# EasyEDA schematic EasyEDA - Encoder Breakout Schematic.json
TITLE: New Schematic; REV: 1.0; Date: 2018-07-22; Sheet: 1/1; Drawn By: NorthernChemist
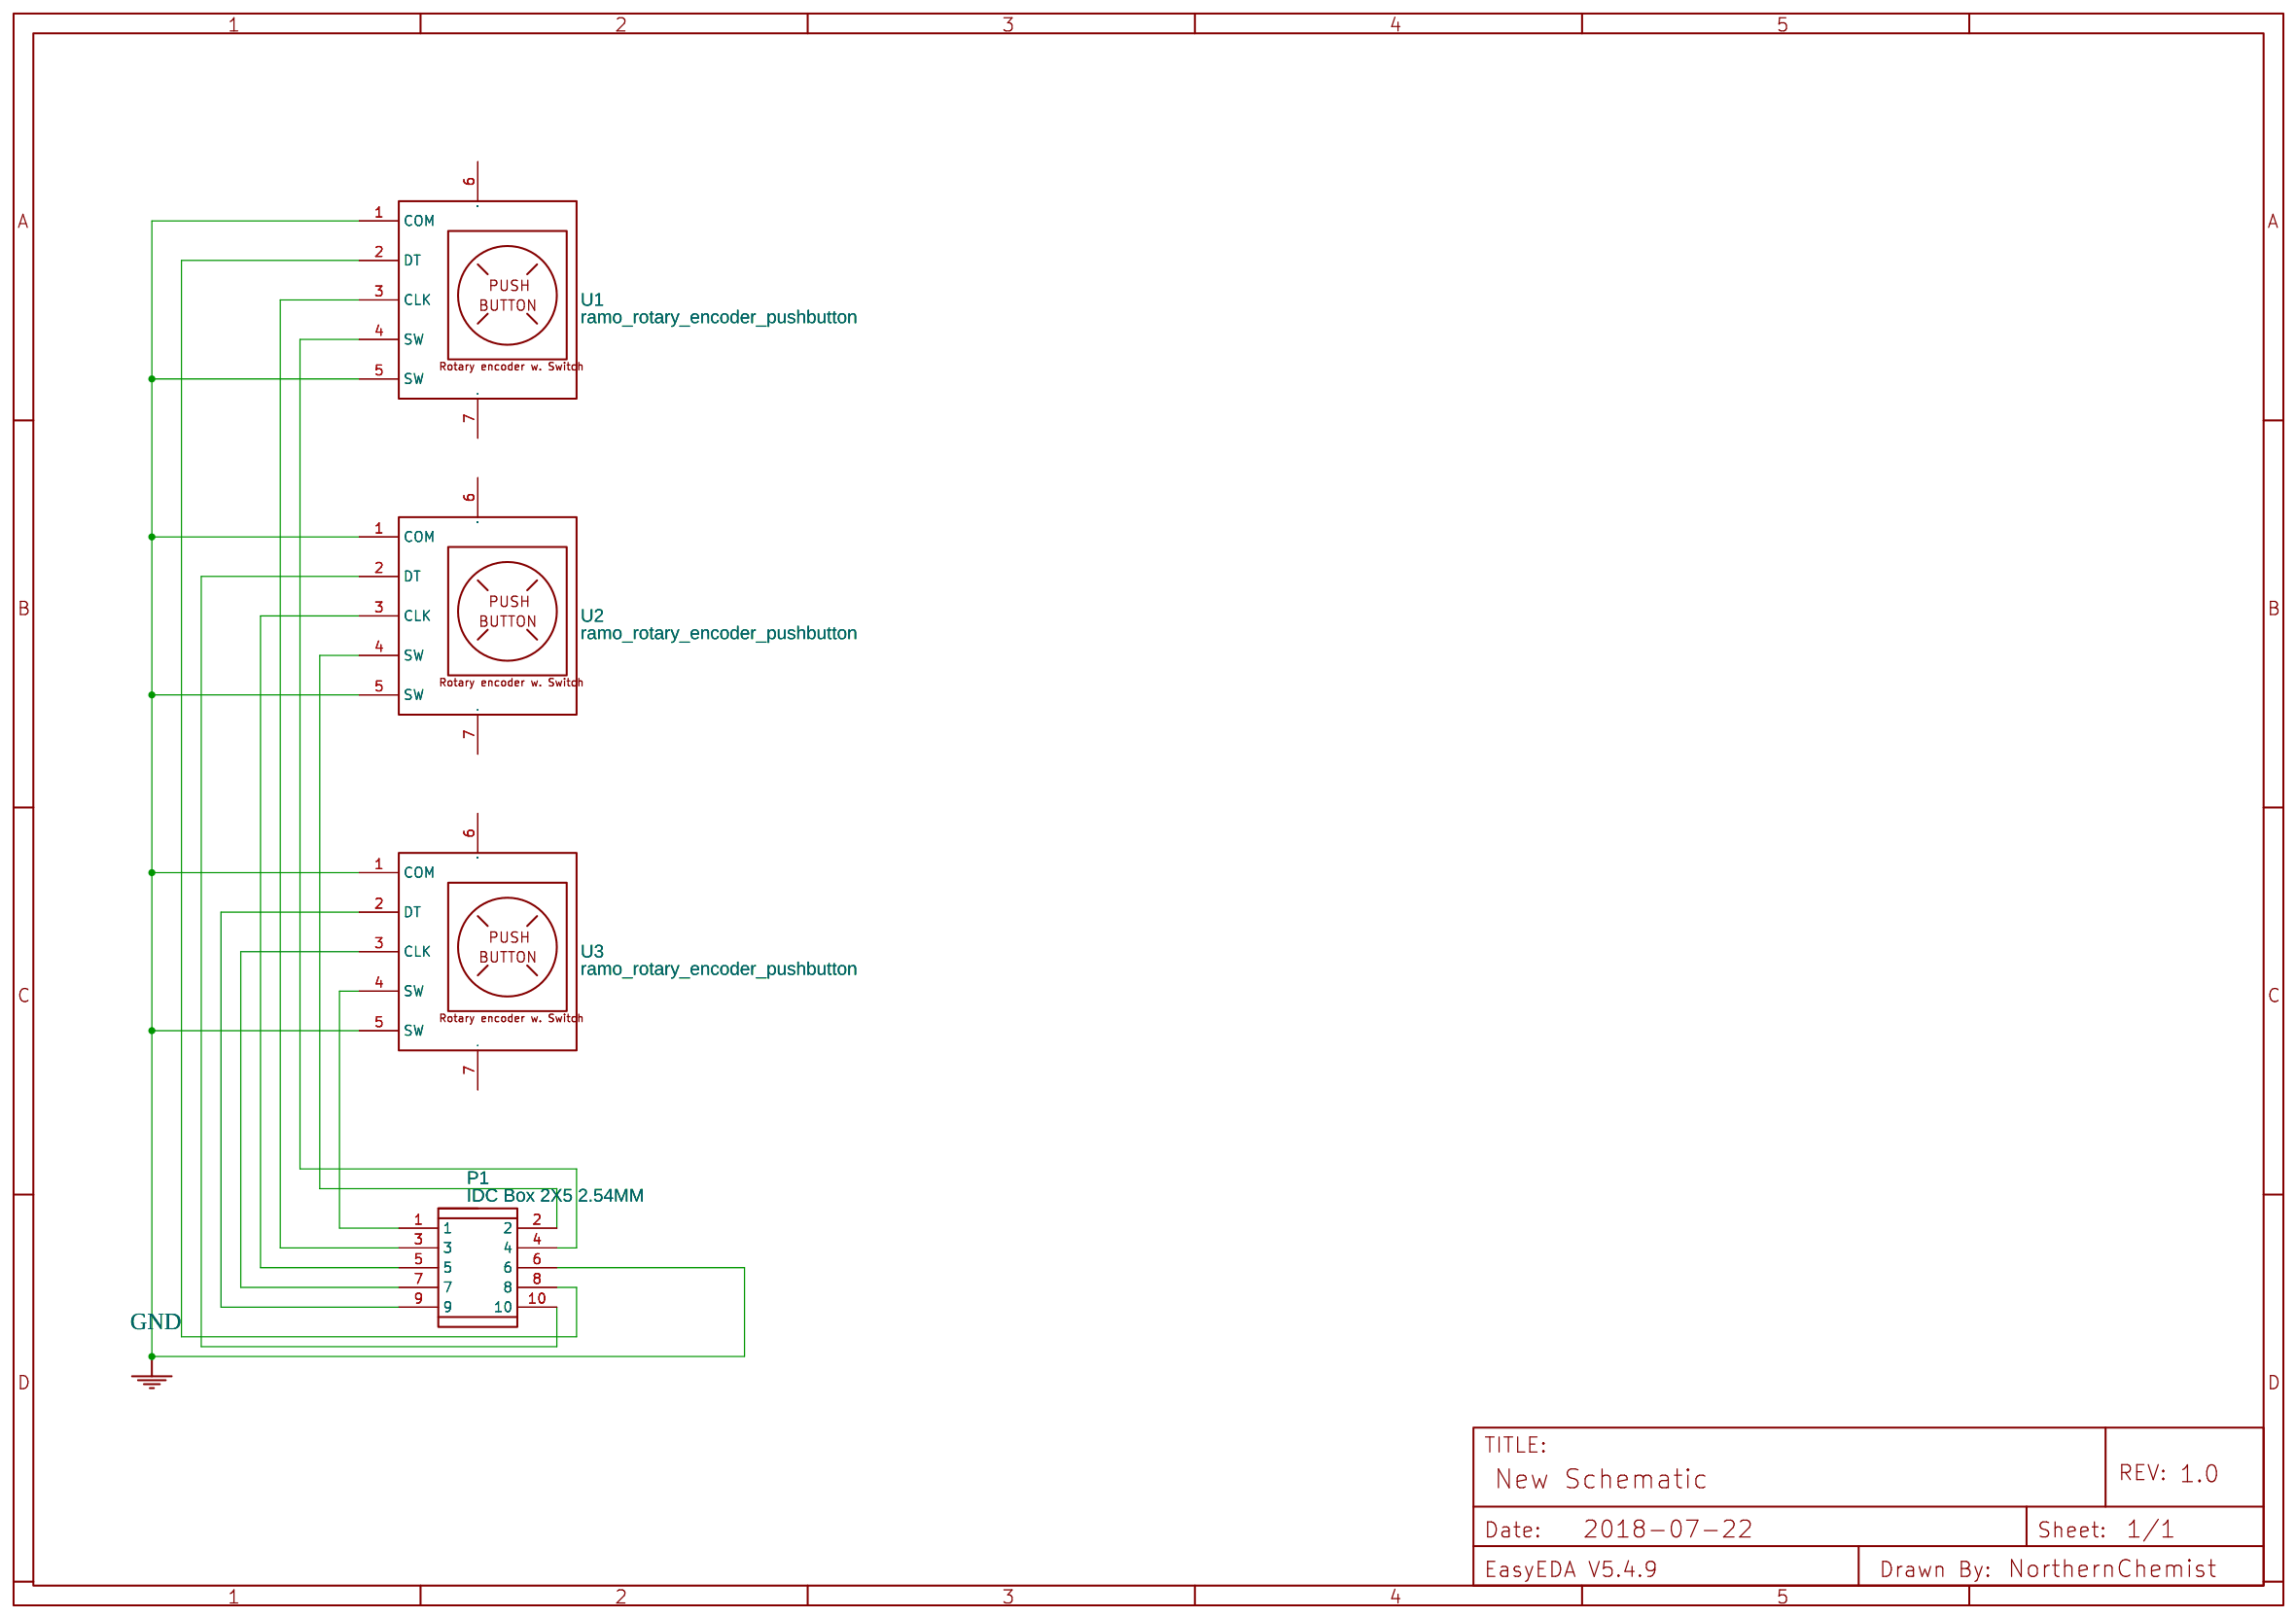
[diagram p0: schematic sheet]

## Parts
P1  IDC Box 2X5 2.54MM  [HDR-IDC-2.54-2X5PW]
U1  ramo_rotary_encoder_pushbutton  [RAMO_ROTARY_ENCODER_PUSHBUTTON]
U2  ramo_rotary_encoder_pushbutton  [RAMO_ROTARY_ENCODER_PUSHBUTTON]
U3  ramo_rotary_encoder_pushbutton  [RAMO_ROTARY_ENCODER_PUSHBUTTON]

## Library data of the parts
P1 = -: Supplier: LCSC; Manufacturer: BOOMELE; Contributor: LCSC; Supplier Part: C9140
U1-U3 = ramo_rotary_encoder_pushbutton: Contributor: ramoheli; Manufacturer Part: ?

## Nets
GND: P1.6 U1.1(COM) U1.5(SW) U2.1(COM) U2.5(SW) U3.1(COM) U3.5(SW)
Net-(P1-1): P1.1 U3.4(SW)
Net-(P1-2): P1.2 U2.4(SW)
Net-(P1-3): P1.3 U1.3(CLK)
Net-(P1-4): P1.4 U1.4(SW)
Net-(P1-5): P1.5 U2.3(CLK)
Net-(P1-7): P1.7 U3.3(CLK)
Net-(P1-8): P1.8 U1.2(DT)
Net-(P1-9): P1.9 U3.2(DT)
Net-(P1-10): P1.10 U2.2(DT)

Not connected (* = marked no-connect by the designer): U1 6 7; U2 6 7; U3 6 7
